# EasyEDA Pro project SimpleFOCShield v3-Redesigned.eprj

# Schematic SimpleFOCShield v3
Board Name: SimpleFOCShield v3; Create Date: 2024-10-09; Page Name: SimpleFOCShieldV3.SchDoc copy; Project Name: SimpleFOCShield v3; Schematic Name: SimpleFOCShield v3; Update Date: 2024-10-09; Add into BOM: yes; Company: SimpleFOCproject; Convert to PCB: yes; Date: 2024-04-28; Draw By: the.skuric; REV: 3.2; Sheet: 1/1
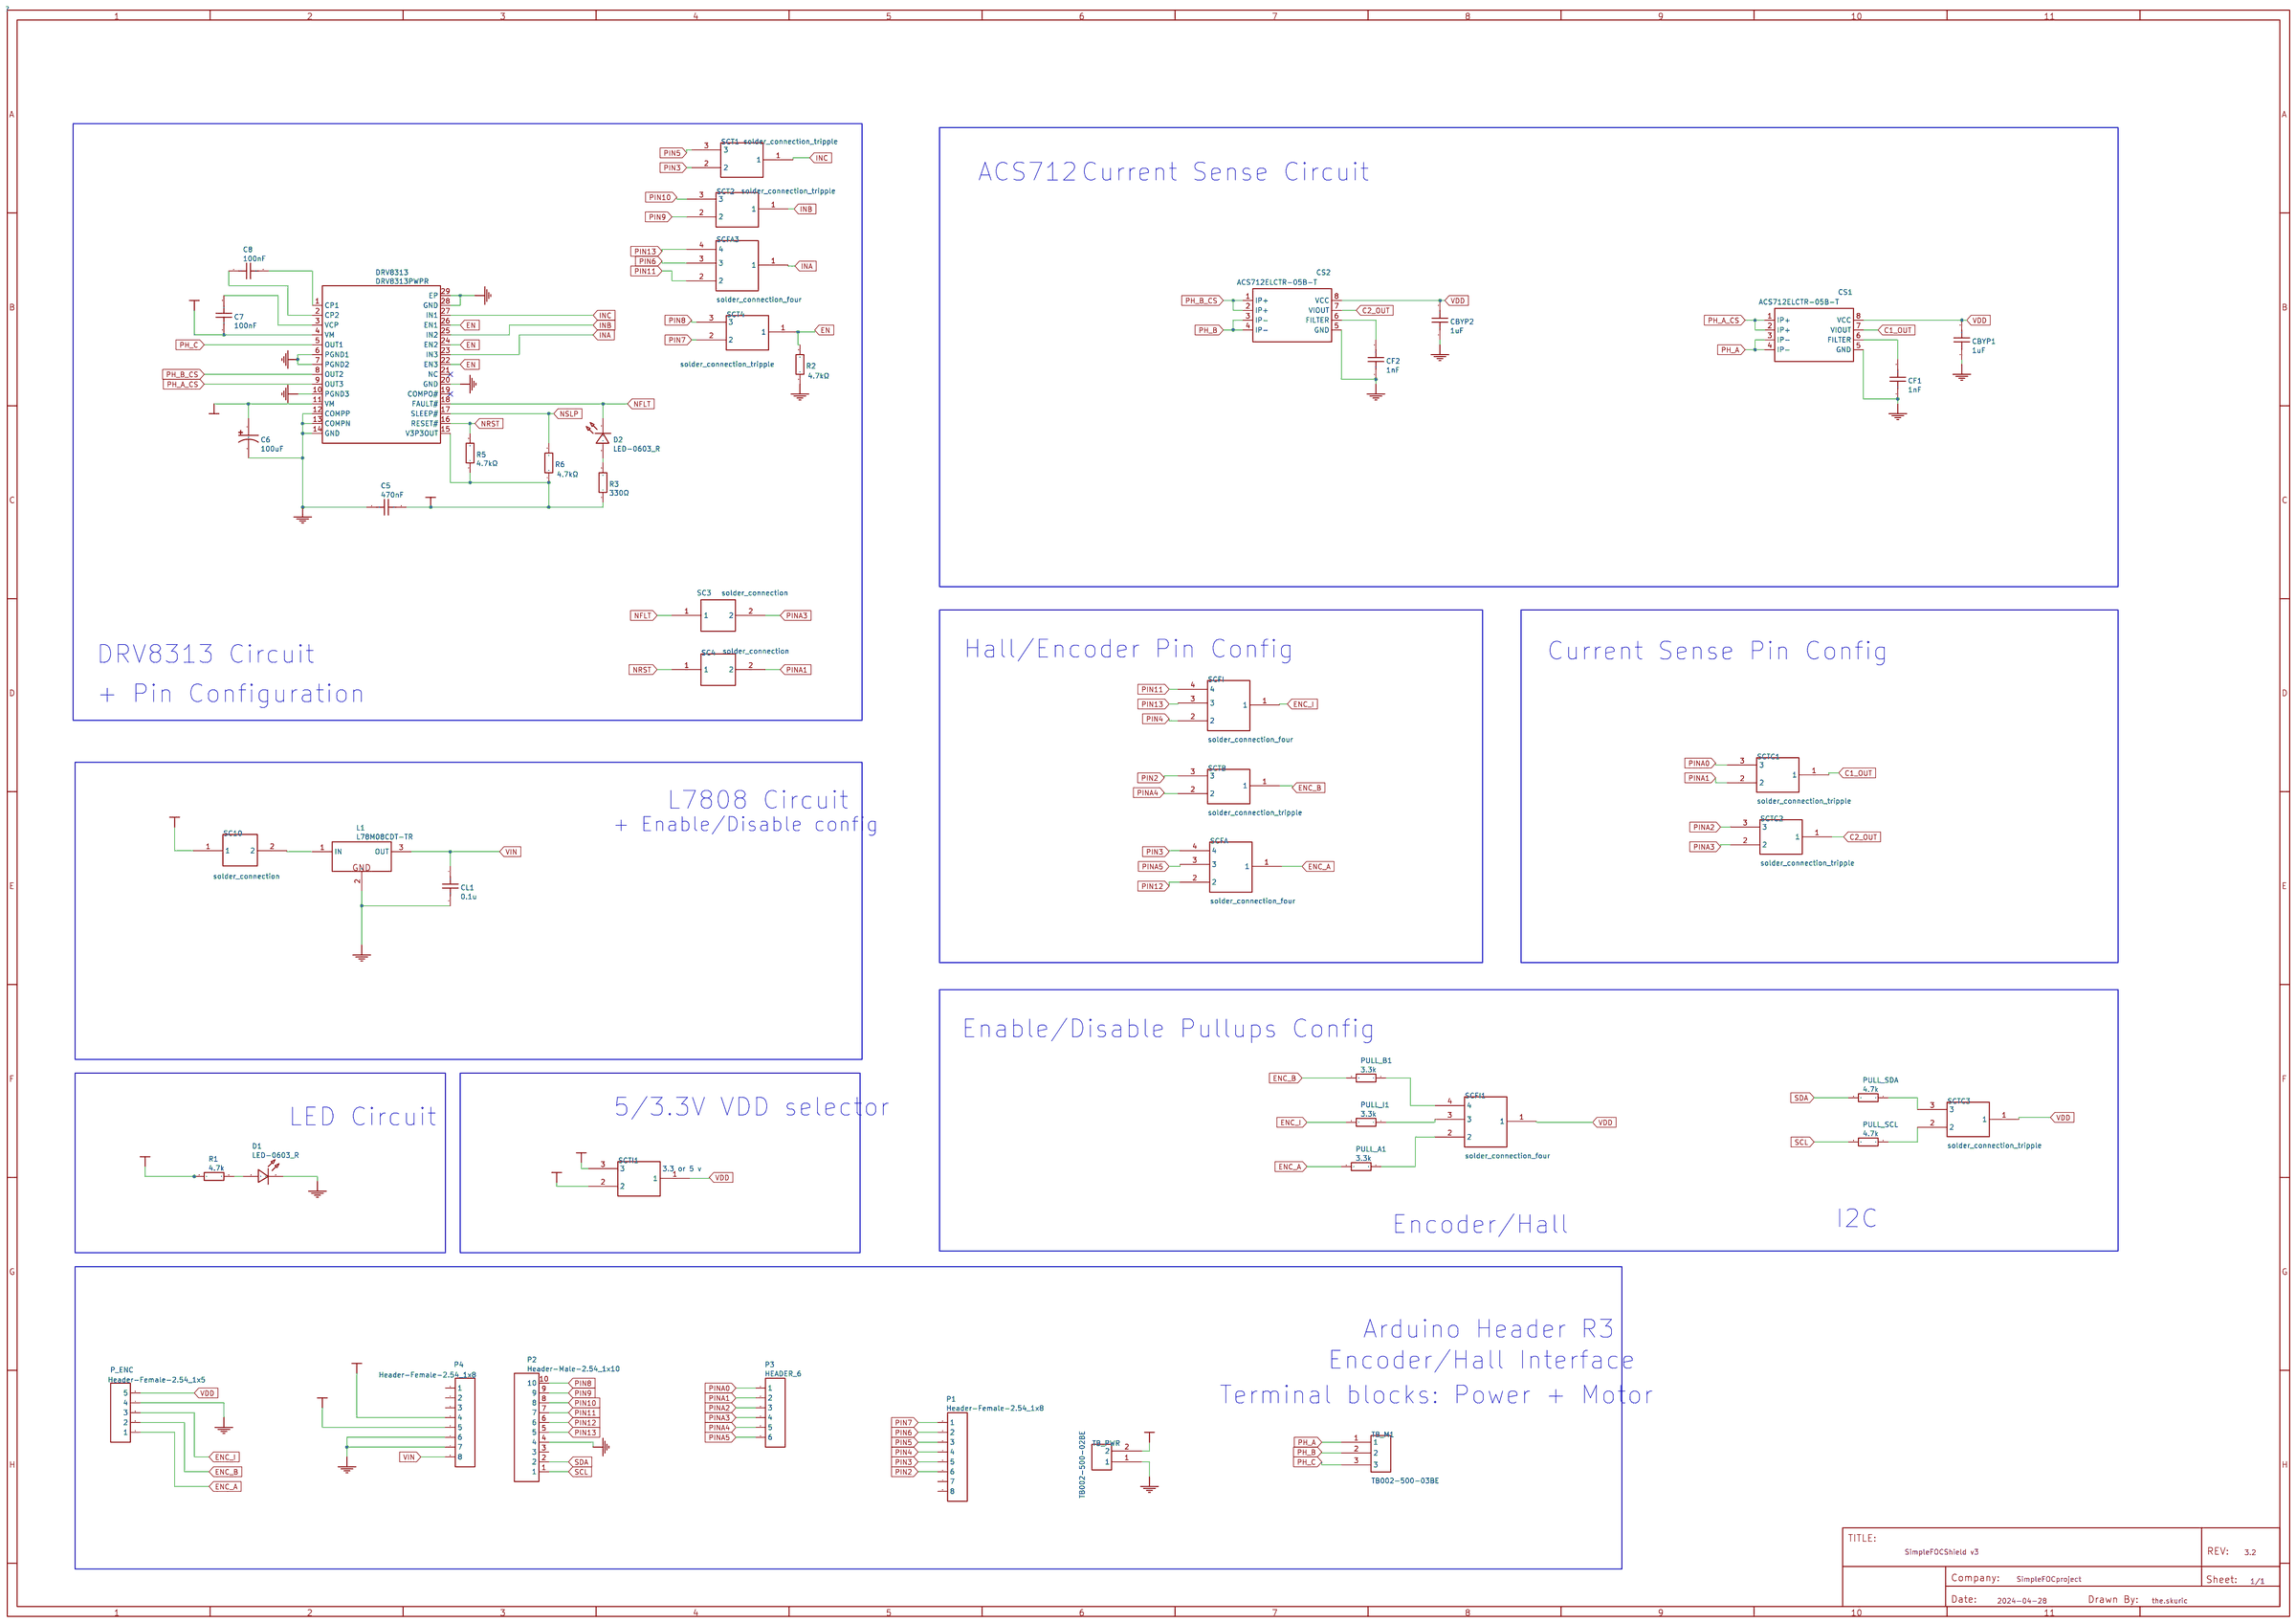
[diagram p0: schematic sheet]

## Parts
C5  470nF  [C0603_1]
C6  100uF  [CAP-SMD_BD6.3-L6.6-W6.6-FD]
C7  100nF  [C0603_1]
C8  100nF  [C0603_1]
CBYP1  1uF  [C0603_1]
CBYP2  1uF  [C0603_1]
CF1  1nF  [C0603_1]
CF2  1nF  [C0603_1]
CL1  0.1u  [C0603_1]
CS1  ACS712ELCTR-05B-T  [SOIC-8_L5.0-W4.0-P1.27-LS6.0-BL]
CS2  ACS712ELCTR-05B-T  [SOIC-8_L5.0-W4.0-P1.27-LS6.0-BL]
D1  LED-0603_R  [LED0603_RED]
D2  LED-0603_R  [LED0603_RED]
DRV8313  DRV8313PWPR  [HTSSOP-28_L9.8-W4.5-P0.65-LS6.6-BL-EP]
L1  L78M08CDT-TR  [TO-252-2_L6.6-W6.1-P4.57-LS9.9-TL-CW]
P1  Header-Female-2.54_1x8  [HDR-TH_8P-P2.54-V-F-1]  (no BOM)
P2  Header-Male-2.54_1x10  [HDR-TH_10P-P2.54-V-M-1]  (no BOM)
P3  HEADER_6  [HDR-M-2.54_1X6]  (no BOM)
P4  Header-Female-2.54_1x8  [HDR-TH_8P-P2.54-V-F-1]  (no BOM)
P_ENC  Header-Female-2.54_1x5  [HDR-TH_5P-P2.54-V-F]  (no BOM)
PULL_A1  3.3k  [R0603_1]
PULL_B1  3.3k  [R0603_1]
PULL_I1  3.3k  [R0603_1]
PULL_SCL  4.7k  [R0603_1]
PULL_SDA  4.7k  [R0603_1]
R1  4.7k  [R0603_1]
R2  4.7kΩ  [R0603_1]
R3  330Ω  [R0603_1]
R5  4.7kΩ  [R0603_1]
R6  4.7kΩ  [R0603_1]
SC3  solder_connection  [SOLDER_CONNECTION]  (no BOM)
SC4  solder_connection  [SOLDER_CONNECTION]  (no BOM)
SC10  solder_connection  [SOLDER_CONNECTION]  (no BOM)
SCFA  solder_connection_four  [SOLDER_CONNECTION_FOUR]  (no BOM)
SCFA3  solder_connection_four  [SOLDER_CONNECTION_FOUR]  (no BOM)
SCFI  solder_connection_four  [SOLDER_CONNECTION_FOUR]  (no BOM)
SCFI1  solder_connection_four  [SOLDER_CONNECTION_FOUR]  (no BOM)
SCT1  solder_connection_tripple  [SOLDER_CONNECTION_TRIPPLE]  (no BOM)
SCT2  solder_connection_tripple  [SOLDER_CONNECTION_TRIPPLE]  (no BOM)
SCT4  solder_connection_tripple  [SOLDER_CONNECTION_TRIPPLE]  (no BOM)
SCTB  solder_connection_tripple  [SOLDER_CONNECTION_TRIPPLE]  (no BOM)
SCTC1  solder_connection_tripple  [SOLDER_CONNECTION_TRIPPLE]  (no BOM)
SCTC2  solder_connection_tripple  [SOLDER_CONNECTION_TRIPPLE]  (no BOM)
SCTC3  solder_connection_tripple  [SOLDER_CONNECTION_TRIPPLE]  (no BOM)
SCTI1  3.3 or 5 v  [SOLDER_CONNECTION_TRIPPLE]  (no BOM)
TB_M1  TB002-500-03BE  [TB002-500-03BE]  (no BOM)
TB_PWR  TB002-500-02BE  [TB002-500-02BE]  (no BOM)

## Library data of the parts
C5 = 470nF: Supplier: LCSC; Supplier Part: C327269; Manufacturer: YAGEO; Manufacturer Part: CC0603ZRY5V6BB474
C6 = 100uF: Supplier: LCSC; Supplier Part: C294520; Manufacturer: Vertical Technology; Manufacturer Part: VT1V101M-CRE77
C7 C8 = 100nF: Supplier: LCSC; Manufacturer: SAMSUNG; Manufacturer Part: CL10B104KB8NNNC; Supplier Part: C1591
CBYP1 CBYP2 = 1uF
CF1 CF2 = 1nF
CL1 = 0.1u
CS1 CS2 = ACS712ELCTR-05B-T: Supplier: LCSC; Manufacturer: ALLEGRO(美国埃戈罗); Supplier Part: C44471; JLCPCB Part Class: Extended Part
D1 = LED-0603_R: Manufacturer: EVERLIGHT(台湾亿光); Manufacturer Part: 19-217/R6C-AL1M2VY/3T; Supplier Part: C72044; Supplier: LCSC
D2 = LED-0603_R: Manufacturer: EVERLIGHT(台湾亿光); Manufacturer Part: 19-217/R6C-AL1M2VY/3T; Supplier Part: C72044; Supplier: Add New Supplier
DRV8313 = DRV8313PWPR: Supplier: LCSC; Supplier Part: C92482; Manufacturer: Texas Instruments; JLCPCB Part Class: Extended Part
L1 = L78M08CDT-TR: Supplier: LCSC; Manufacturer: STMicroelectronics; Supplier Part: C158076; JLCPCB Part Class: Extended Part
P1 P4 = Header-Female-2.54_1x8: Supplier: LCSC; Manufacturer: BOOMELE; Manufacturer Part: Female headerHDR1X8-2.54; Supplier Part: C27438; JLCPCB Part Class: Extended Part
P2 = Header-Male-2.54_1x10: Supplier: LCSC; Manufacturer Part: Headers  Pins2.54mm1*10P; Supplier Part: C57369; JLCPCB Part Class: Extended Part
P3 = HEADER_6
P_ENC = Header-Female-2.54_1x5: Supplier: LCSC; Manufacturer: BOOMELE; Manufacturer Part: 2.54mm 1*5p Female header; Supplier Part: C50950; JLCPCB Part Class: Extended Part
PULL_A1 PULL_B1 PULL_I1 = 3.3k: Supplier: LCSC; JLCPCB Part Class: Basic Part
PULL_SCL PULL_SDA R1 = 4.7k: Supplier: LCSC; Manufacturer: UniOhm; Manufacturer Part: 0603WAF4701T5E; Supplier Part: C23162; Resistance: 4.7K; JLCPCB Part Class: Basic Part
R2 R5 R6 = 4.7kΩ: Supplier: LCSC; Manufacturer: UniOhm; Manufacturer Part: 0603WAF4701T5E; Supplier Part: C23162; Resistance: 4.7K; JLCPCB Part Class: Basic Part
R3 = 330Ω: Resistance: 330; JLCPCB Part Class: Basic Part
SC3 SC4 SC10 = solder_connection
SCFA SCFA3 SCFI SCFI1 = solder_connection_four
SCT1 SCT2 SCT4 SCTB SCTC1-SCTC3 = solder_connection_tripple
SCTI1 = 3.3 or 5 v
TB_M1 = TB002-500-03BE: Supplier 1: Mouser; Supplier Part Number 1: 490-TB002-500-03BE
TB_PWR = TB002-500-02BE: Supplier 1: Mouser; Supplier Part Number 1: 490-TB002-500-02BE

## Nets
3.3V: C5.2 DRV8313.15(V3P3OUT) R3.1 R5.1 R6.1
+5V: P4.5 SCTI1.2
GND: C5.1 C6.2 CBYP1.1 CBYP2.1 CF1.1 CF2.1 CL1.2 CS1.5(GND) CS2.5(GND) D1.2 DRV8313.6(PGND1) DRV8313.7(PGND2) DRV8313.10(PGND3) DRV8313.12(COMPP) DRV8313.13(COMPN) DRV8313.14(GND) DRV8313.20(GND) DRV8313.28(GND) DRV8313.29(EP) L1.2(GND) P2.4 P4.6 P4.7 P_ENC.4 R2.1 TB_PWR.1
P3.3V: P4.4 SCTI1.3
VCC: C6.1 C7.1 DRV8313.4(VM) DRV8313.11(VM) R1.2 SC10.1 TB_PWR.2
VDD: CBYP1.2 CBYP2.2 CS1.8(VCC) CS2.8(VCC) P_ENC.5 SCFI1.1 SCTC3.1 SCTI1.1
VIN: CL1.1 L1.3(OUT) P4.8
C1_OUT: CS1.7(VIOUT) SCTC1.1
C2_OUT: CS2.7(VIOUT) SCTC2.1
EN: DRV8313.22(EN3) DRV8313.24(EN2) DRV8313.26(EN1) R2.2 SCT4.1
ENC_A: P_ENC.1 PULL_A1.2 SCFA.1
ENC_B: P_ENC.2 PULL_B1.2 SCTB.1
ENC_I: P_ENC.3 PULL_I1.2 SCFI.1
INA: DRV8313.23(IN3) SCFA3.1
INB: DRV8313.25(IN2) SCT2.1
INC: DRV8313.27(IN1) SCT1.1
NFLT: D2.2 DRV8313.18(FAULT#) SC3.1
NRST: DRV8313.16(RESET#) R5.2 SC4.1
NSLP: DRV8313.17(SLEEP#) R6.2
PH_A: CS1.3(IP-) CS1.4(IP-) TB_M1.1
PH_A_CS: CS1.1(IP+) CS1.2(IP+) DRV8313.9(OUT3)
PH_B: CS2.3(IP-) CS2.4(IP-) TB_M1.2
PH_B_CS: CS2.1(IP+) CS2.2(IP+) DRV8313.8(OUT2)
PH_C: DRV8313.5(OUT1) TB_M1.3
PIN2: P1.6 SCTB.3
PIN3: P1.5 SCFA.4 SCT1.2
PIN4: P1.4 SCFI.2
PIN5: P1.3 SCT1.3
PIN6: P1.2 SCFA3.3
PIN7: P1.1 SCT4.2
PIN8: P2.10 SCT4.3
PIN9: P2.9 SCT2.2
PIN10: P2.8 SCT2.3
PIN11: P2.7 SCFA3.2 SCFI.4
PIN12: P2.6 SCFA.2
PIN13: P2.5 SCFA3.4 SCFI.3
PINA0: P3.1 SCTC1.3
PINA1: P3.2 SC4.2 SCTC1.2
PINA2: P3.3 SCTC2.3
PINA3: P3.4 SC3.2 SCTC2.2
PINA4: P3.5 SCTB.2
PINA5: P3.6 SCFA.3
SCL: P2.1 PULL_SCL.2
SDA: P2.2 PULL_SDA.2
$1N20: C7.2 DRV8313.3(VCP)
$1N21: C8.1 DRV8313.2(CP2)
$1N22: C8.2 DRV8313.1(CP1)
$1N41: L1.1(IN) SC10.2
$1N43: D1.1 R1.1
$1N70: PULL_SDA.1 SCTC3.3
$1N110: CF2.2 CS2.6(FILTER)
$1N112: CF1.2 CS1.6(FILTER)
$1N114: D2.1 R3.2
$1N120: PULL_SCL.1 SCTC3.2
$1N122: PULL_A1.1 SCFI1.2
$1N125: PULL_B1.1 SCFI1.4
$1N126: PULL_I1.1 SCFI1.3

Not connected (* = marked no-connect by the designer): DRV8313 19(COMPO#)* 21(NC)*; P1 7 8; P2 3; P4 1 2 3

## Notes on the sheet
- ACS712
- Current Sense Circuit
- DRV8313 Circuit
- Hall/Encoder Pin Config
- Current Sense Pin Config
- + Pin Configuration
- L7808 Circuit
- + Enable/Disable config
- Enable/Disable Pullups Config
- 5/3.3V VDD selector
- LED Circuit
- Encoder/Hall
- I2C
- Arduino Header R3
- Encoder/Hall Interface
- Terminal blocks: Power + Motor

# Board SimpleFOCShieldV3.PcbDoc copy
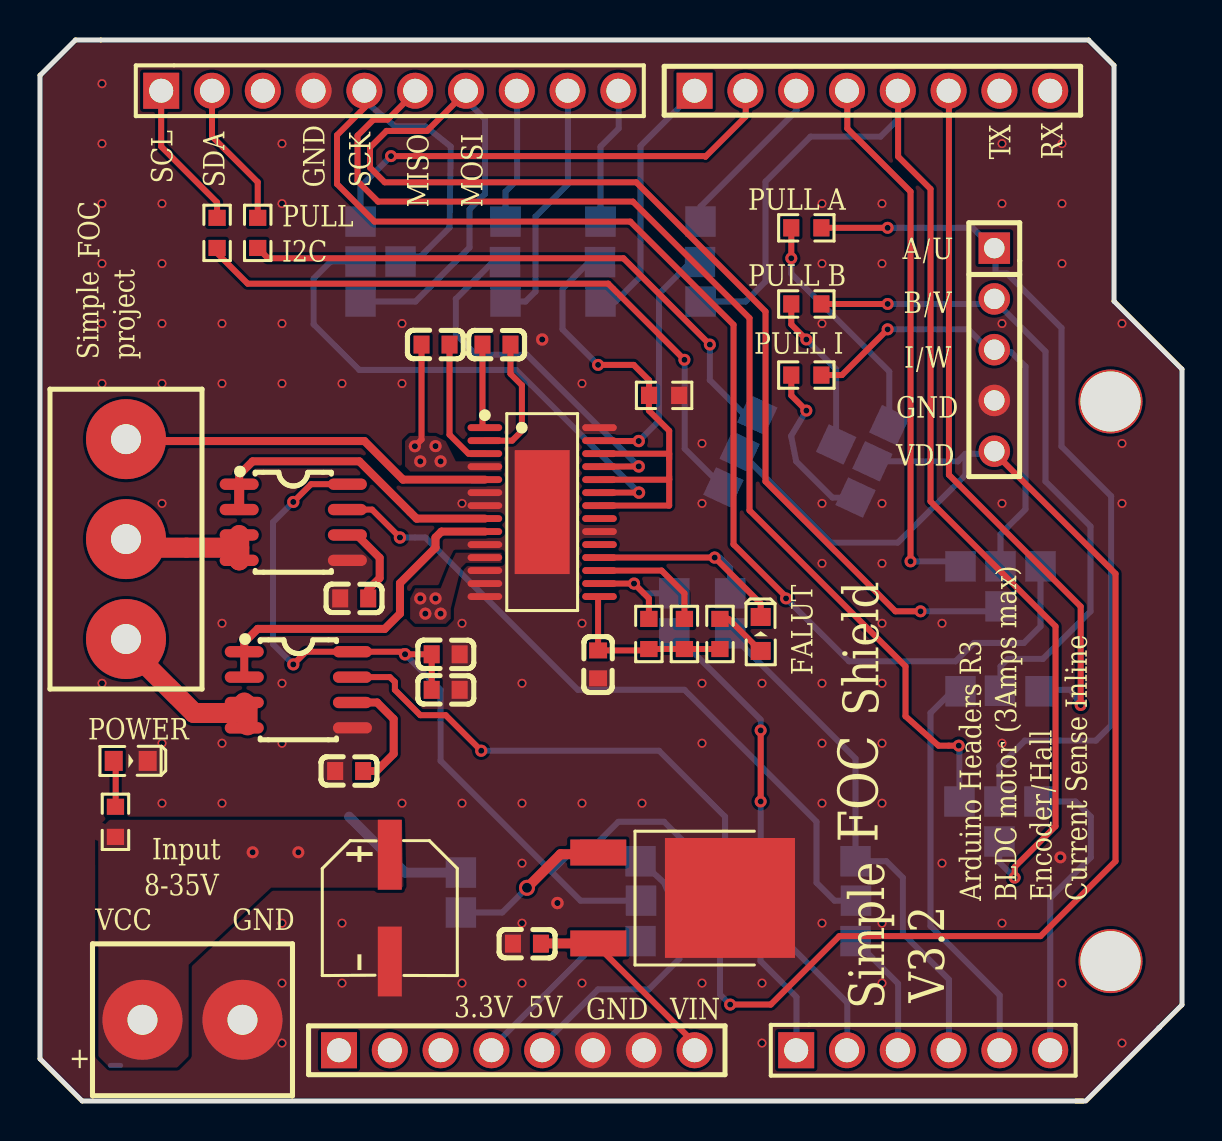
[diagram p1: board, top side]
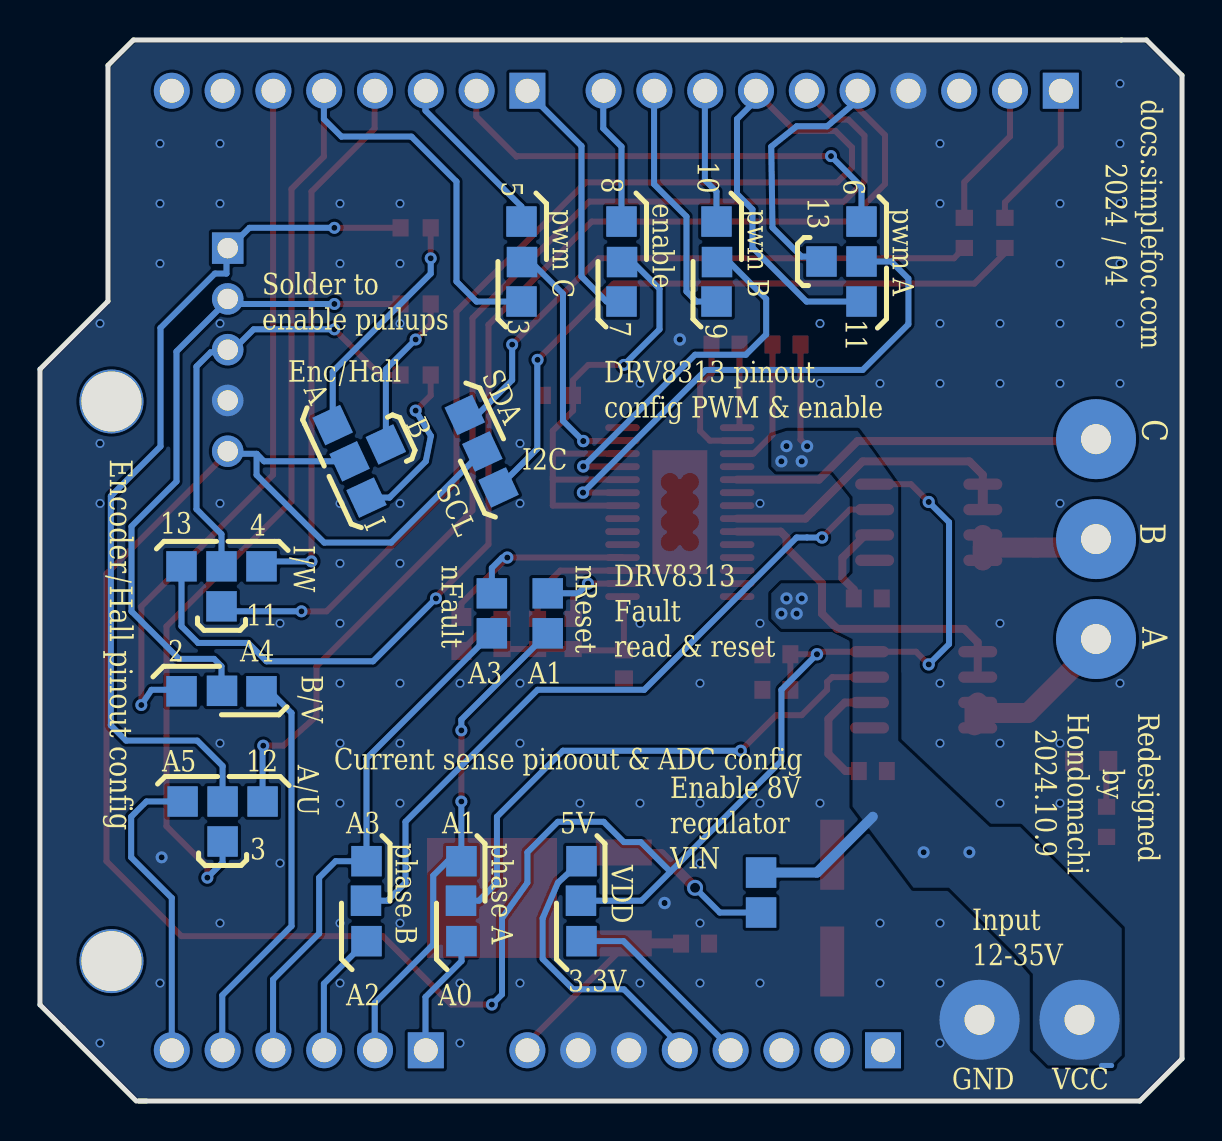
[diagram p2: board, bottom side, seen from below]

Outline 57.1 x 53.09 mm; copper layers: Top Layer, Bottom Layer. Coordinates in mm from the lower left corner of the outline.
Outline path: 51.78,0 52.16,0 2.11,0 0,2.11 0,51.31 1.78,53.09 52.43,53.09 53.7,51.81 53.7,40.01 57.1,36.61 57.1,4.81 52.29,0
Stack: Top Layer 0.035mm / Dielectric1 1.51mm FR4 er 4.5 / Bottom Layer 0.035mm

## Design rules (mm)
spacing Default (default): track to track 0.152, other pairs 0 to 0.152
spacing Plane_Default: track to track 0.152, other pairs 0 to 0.152
spacing Copper_Default: track to track 0.152, other pairs 0 to 0.152
spacing Copper_CopperRegion: track to track 0.152, other pairs 0 to 0.152
spacing Copper_(1): track to track 0.152, other pairs 0 to 0.152
spacing Copper_(2): track to track 0.152, other pairs 0 to 0.152
spacing Copper_(3): track to track 0.152, other pairs 0 to 0.152
track width Default (default): min 0.152, default 0.152, max 25.4
differential pair differentialPair (default): width min 0.127, default 0.254, max 2.54; gap min 0.152, default 0.152
pour e545 uses (1), Copper_Default
pour e551 uses Copper_Default, Default
pour e556 uses (3), Copper_Default
pour e548 uses Copper_Default

## Placement (name value [footprint] x y rotation side)
C5  470nF  [C0603_1]  27.9 21.84 90 top
C6  100uF  [CAP-SMD_BD6.3-L6.6-W6.6-FD]  17.49 9.65 270 top
C7  100nF  [C0603_1]  19.78 37.85 0 top
C8  100nF  [C0603_1]  22.82 37.85 180 top
CBYP1  1uF  [C0603_1]  20.28 22.35 180 top
CBYP2  1uF  [C0603_1]  20.28 20.57 180 top
CF1  1nF  [C0603_1]  15.46 16.51 0 top
CF2  1nF  [C0603_1]  15.71 25.14 0 top
CL1  0.1u  [C0603_1]  24.35 7.87 180 top
CS1  ACS712ELCTR-05B-T  [SOIC-8_L5.0-W4.0-P1.27-LS6.0-BL]  12.92 20.57 270 top
CS2  ACS712ELCTR-05B-T  [SOIC-8_L5.0-W4.0-P1.27-LS6.0-BL]  12.66 28.96 270 top
D1  LED-0603_R  [LED0603_RED]  4.54 17.02 0 top
D2  LED-0603_R  [LED0603_RED]  36.03 23.37 90 top
DRV8313  DRV8313PWPR  [HTSSOP-28_L9.8-W4.5-P0.65-LS6.6-BL-EP]  25.11 29.46 270 top
L1  L78M08CDT-TR  [TO-252-2_L6.6-W6.1-P4.57-LS9.9-TL-CW]  31.21 10.16 0 top
NOREF  -  [Pad_e135]  53.53 35 0 top
NOREF#2  -  [Pad_e136]  53.53 7 0 top
P1  Header-Female-2.54_1x8  [HDR-TH_8P-P2.54-V-F-1]  41.62 50.55 0 top
P2  Header-Male-2.54_1x10  [HDR-TH_10P-P2.54-V-M-1]  17.49 50.55 0 top
P3  HEADER_6  [HDR-M-2.54_1X6]  44.16 2.54 0 top
P4  Header-Female-2.54_1x8  [HDR-TH_8P-P2.54-V-F-1]  23.84 2.54 0 top
P_ENC  Header-Female-2.54_1x5  [HDR-TH_5P-P2.54-V-F]  47.72 37.59 270 top
PULL_A1  3.3k  [R0603_1]  38.32 43.69 0 top
PULL_B1  3.3k  [R0603_1]  38.32 39.88 0 top
PULL_I1  3.3k  [R0603_1]  38.32 36.32 0 top
PULL_SCL  4.7k  [R0603_1]  8.85 43.43 90 top
PULL_SDA  4.7k  [R0603_1]  10.89 43.43 90 top
R1  4.7k  [R0603_1]  3.77 13.97 270 top
R2  4.7kΩ  [R0603_1]  31.21 35.3 180 top
R3  330Ω  [R0603_1]  34 23.37 90 top
R5  4.7kΩ  [R0603_1]  30.44 23.37 90 top
R6  4.7kΩ  [R0603_1]  32.22 23.37 90 top
SC3  solder_connection  [SOLDER_CONNECTION]  34.51 25.4 270 bottom
SC4  solder_connection  [SOLDER_CONNECTION]  31.71 25.4 270 bottom
SC10  solder_connection  [SOLDER_CONNECTION]  21.05 11.43 270 bottom
SCFA  solder_connection_four  [SOLDER_CONNECTION_FOUR]  47.97 14.99 180 bottom
SCFA3  solder_connection_four  [SOLDER_CONNECTION_FOUR]  16.03 42 270 bottom
SCFI  solder_connection_four  [SOLDER_CONNECTION_FOUR]  48.03 26.75 180 bottom
SCFI1  solder_connection_four  [SOLDER_CONNECTION_FOUR]  41.62 32 65 bottom
SCT1  solder_connection_tripple  [SOLDER_CONNECTION_TRIPPLE]  33.03 42 270 bottom
SCT2  solder_connection_tripple  [SOLDER_CONNECTION_TRIPPLE]  23.28 42 270 bottom
SCT4  solder_connection_tripple  [SOLDER_CONNECTION_TRIPPLE]  28.03 42 270 bottom
SCTB  solder_connection_tripple  [SOLDER_CONNECTION_TRIPPLE]  48.03 20.5 180 bottom
SCTC1  solder_connection_tripple  [SOLDER_CONNECTION_TRIPPLE]  36.03 10 90 bottom
SCTC2  solder_connection_tripple  [SOLDER_CONNECTION_TRIPPLE]  40.78 10 90 bottom
SCTC3  solder_connection_tripple  [SOLDER_CONNECTION_TRIPPLE]  35.02 32.51 245 bottom
SCTI1  3.3 or 5 v  [SOLDER_CONNECTION_TRIPPLE]  30.03 10 90 bottom
TB_M1  -  [TB002-500-03BE]  4.3 23.11 90 top
TB_PWR  -  [TB002-500-02BE]  10.12 4.06 180 top

## Footprints (pads in the part's own frame, mm; a bottom-side part is the same pattern mirrored in y, then rotated)
C0603_1
  rect 0.8x0.9 smd: 1(-0.7,0) 2(0.7,0)
CAP-SMD_BD6.3-L6.6-W6.6-FD
  rect 3.5x1.2 smd: 1(-2.67,0) 2(2.67,0)
HDR-M-2.54_1X6
  rect 1.8x1.8 hole 1.2: 1(-6.35,0)
  round 1.8 hole 1.2: 2(-3.81,0) 3(-1.27,0) 4(1.27,0) 5(3.81,0) 6(6.35,0)
HDR-TH_5P-P2.54-V-F
  rect 1.575x1.575 hole 1.02: 1(-5.08,0)
  round 1.575 hole 1.02: 2(-2.54,0) 3(0,0) 4(2.54,0) 5(5.08,0)
HDR-TH_8P-P2.54-V-F-1
  rect 1.8x1.8 hole 1.2: 1(-8.89,0)
  round 1.8 hole 1.2: 2(-6.35,0) 3(-3.81,0) 4(-1.27,0) 5(1.27,0) 6(3.81,0) 7(6.35,0) 8(8.89,0)
HDR-TH_10P-P2.54-V-M-1
  rect 1.8x1.8 hole 1.2: 1(-11.43,0)
  round 1.8 hole 1.2: 2(-8.89,0) 3(-6.35,0) 4(-3.81,0) 5(-1.27,0) 6(1.27,0) 7(3.81,0) 8(6.35,0) 9(8.89,0) 10(11.43,0)
HTSSOP-28_L9.8-W4.5-P0.65-LS6.6-BL-EP
  oval 0.343x1.732 smd: 1(-4.225,-2.865) 2(-3.575,-2.865) 3(-2.925,-2.865) 4(-2.275,-2.865) 5(-1.625,-2.865) 6(-0.975,-2.865) 7(-0.325,-2.865) 8(0.325,-2.865) 9(0.975,-2.865) 10(1.625,-2.865) 11(2.275,-2.865) 12(2.925,-2.865) 13(3.575,-2.865) 14(4.225,-2.865) 15(4.225,2.866) 16(3.575,2.866) 17(2.925,2.866) 18(2.275,2.866) 19(1.625,2.866) 20(0.975,2.866) 21(0.325,2.866) 22(-0.325,2.866) 23(-0.975,2.866) 24(-1.625,2.866) 25(-2.275,2.866) 26(-2.925,2.866) 27(-3.575,2.866) 28(-4.225,2.866)
  rect 6.2x2.75 smd: 29(0,0.001)
LED0603_RED
  rect 0.9x1 smd: 1(-0.85,0) 2(0.85,0)
Pad_e135
  round 3.2 hole 3.005x3: T2(0,0)
Pad_e136
  round 3.2 hole 3.005x3: T3(0,0)
R0603_1
  rect 0.806x0.864 smd: 1(-0.753,0) 2(0.753,0)
SOIC-8_L5.0-W4.0-P1.27-LS6.0-BL
  oval 0.569x1.95 smd: 1(-1.905,-2.705) 2(-0.635,-2.705) 3(0.635,-2.705) 4(1.905,-2.705) 5(1.905,2.705) 6(0.635,2.705) 7(-0.635,2.705) 8(-1.905,2.705)
SOLDER_CONNECTION
  rect 1.524x1.524 smd: 1(0,0) 2(2,0)
SOLDER_CONNECTION_FOUR
  rect 1.524x1.524 smd: 1(0,0) 2(2,0) 3(-2,0) 4(0,-2)
SOLDER_CONNECTION_TRIPPLE
  rect 1.524x1.524 smd: 1(0.025,0.025) 2(2,0) 3(-2,0)
TB002-500-02BE
  round 4 hole 1.5: 1(0,0) 2(5,0)
TB002-500-03BE
  round 4 hole 1.5: 1(0,0) 2(5,0) 3(10,0)
TO-252-2_L6.6-W6.1-P4.57-LS9.9-TL-CW
  rect 2.8x1.3 smd: 1(-3.292,2.273) 3(-3.292,-2.272)
  rect 6.5x6 smd: 2(3.292,0)

## Nets
As in the schematic.

Pads without a net: DRV8313 19 21; NOREF T2; NOREF#2 T3; P1 7 8; P2 3; P4 1 2 3

## Via types
v1: diameter 0.61, hole 0.305, Top Layer to Bottom Layer, 13 vias
v2: diameter 0.6, hole 0.3, Top Layer to Bottom Layer, 22 vias
v3: diameter 0.45, hole 0.3, Top Layer to Bottom Layer, 91 vias
v4: diameter 0.62, hole 0.31, Top Layer to Bottom Layer, 7 vias
v5: diameter 0.8, hole 0.5, Top Layer to Bottom Layer, 1 via

## Routing (per net, layer and track width the routed paths; a pad name or vN(x,y) marks a point on that pad's centre or on a via; arc(x,y) is an arc through that point)
3.3V: length 8.9
  Top Layer w0.3: 27.98,25.24 27.9,25.17 C5.2 30.37,22.54 R5.1 R3.1
+5V: length 14.5
  Bottom Layer w0.3: P4.5 25.11,2.79 27.9,5.59 30.44,5.59 31.97,7.11 31.97,9.14 31.21,10.92 SCTI1.2
GND:
  vias: v2(51.02,12.19) v3(3.1,50.9) v3(3.1,47.9) v3(3.1,44.9) v3(3.1,41.9) v3(3.1,38.9) v3(3.1,35.9) v3(3.1,20.9) v3(6.1,44.9) v3(6.1,41.9) v3(6.1,38.9) v3(6.1,35.9) v3(6.1,29.9) v3(6.1,17.9) v3(6.1,14.9) v3(9.1,38.9) v3(9.1,35.9) v3(9.1,23.9) v3(9.1,17.9) v3(9.1,14.9) v3(12.1,47.9) v3(12.1,44.9) v3(12.1,38.9) v3(12.1,35.9) v3(12.1,20.9) v3(12.1,17.9) v3(12.1,8.9) v3(12.1,5.9) v3(12.1,2.9) v3(15.1,35.9) v3(15.1,8.9) v3(15.1,5.9) v3(18.1,38.9) v3(18.1,35.9) v3(18.1,14.9) v3(21.1,29.9) v3(21.1,23.9) v3(21.1,14.9) v3(21.1,5.9) v3(24.1,20.9) v3(24.1,14.9) v3(24.1,11.9) v3(24.1,8.9) v3(24.1,5.9) v3(27.1,35.9) v3(27.1,23.9) v3(27.1,14.9) v3(27.1,5.9) v3(30.1,14.9) v3(33.1,32.9) v3(33.1,29.9) v3(33.1,20.9) v3(33.1,17.9) v3(33.1,5.9) v3(36.1,20.9) v3(36.1,5.9) v3(36.1,2.9) v3(39.1,44.9) v3(39.1,41.9) v3(39.1,38.9) v3(39.1,29.9) v3(39.1,26.9) v3(39.1,20.9) v3(39.1,17.9) v3(39.1,14.9) v3(39.1,8.9) v3(42.1,44.9) v3(42.1,41.9) v3(42.1,29.9) v3(42.1,26.9) v3(42.1,23.9) v3(42.1,20.9) v3(42.1,17.9) v3(42.1,14.9) v3(42.1,8.9) v3(42.1,5.9) v3(45.1,23.9) v3(45.1,11.9) v3(48.1,47.9) v3(48.1,44.9) v3(48.1,38.9) v3(48.1,29.9) v3(48.1,17.9) v3(48.1,8.9) v3(51.1,47.9) v3(51.1,44.9) v3(51.1,41.9) v3(51.1,5.9) v3(54.1,38.9) v3(54.1,32.9) v3(54.1,29.9) v3(54.1,2.9) v4(25.11,38.1) v4(25.87,9.91)
P3.3V: length 9.8
  Bottom Layer w0.3: 22.57,2.54 22.57,2.64 27.93,8 30.03,8
VCC: length 12.8
  Top Layer w0.3: v1(18.74,32.76) 19.08,33.09 C7.1
  Top Layer w0.5: 3.53,4 3.53,4.35
  Bottom Layer w0.254: 4.03,1.78 3.52,1.78
  Bottom Layer w0.5: SC10.1 18.25,11.43 15.46,14.22
  vias: v1(19.01,32) v1(19.01,25.15) v1(19.27,24.38) v1(19.78,32.77) v1(19.78,25.15) v1(20.03,32) v1(20.03,24.38) v2(10.63,12.45) v2(12.92,12.45)
VDD: length 124.2
  Top Layer w0.3: CS2.8 13.55,30.86 v1(12.66,29.97) ; v1(12.66,21.84) 13.3,22.48 CS1.8 18.12,22.48 v4(18.25,22.35) 19.58,22.35 CBYP2.2 ; v2(34.51,4.83) 36.54,4.83 39.96,8.25 50.03,8.25 53.78,12 53.78,26.38 47.78,32.38
  Bottom Layer w0.3: v1(12.66,29.97) 11.65,28.96 11.65,22.86 v1(12.66,21.84) ; 46.27,32.38 47.78,32.38 ; 46.27,32.38 46.27,31.32 42.89,27.94 39.54,27.94 34.98,32.5 ; 46.27,32.38 45.9,32 SCFI1.1 ; 25.58,11.47 27.06,12.95 27.9,12.95 28.92,13.97 31.21,13.97 32.73,12.45 32.73,10.92 34,9.14 34,5.33 v2(34.51,4.83) ; SCTI1.1 27.02,10.02 20.03,17.02 20.03,20.57 v4(18.25,22.35)
VIN: length 10.1
  Top Layer w0.3: 32.73,2.54 32.73,2.9 27.85,7.78
  Top Layer w0.5: L1.3 25.31,7.89 CL1.1
C1_OUT: length 27.2
  Top Layer w0.3: v1(22.06,17.53) 20.28,19.3 19.01,19.3 17.74,20.57 17.74,20.97 17.49,21.21 CS1.7
  Bottom Layer w0.3: SCTC1.1 35.15,10.02 34.25,10.92 34.25,14.22 30.95,17.53 v1(22.06,17.53)
C2_OUT: length 35.3
  Top Layer w0.3: CS2.7 16.6,29.59 v4(18,28.19)
  Bottom Layer w0.3: 40.8,10.02 39.72,10.02 38.83,10.92 38.83,13.97 32.22,20.57 26.89,20.57 19.27,28.19 v4(18,28.19)
EN: length 27.4
  Top Layer w0.3: 30.44,35.31 30.44,34.54 31.46,33.53 31.46,32.13 ; DRV8313.26 31.46,32.39 31.46,31.09 DRV8313.24 ; DRV8313.22 31.46,29.79 31.46,31.24 ; v2(27.9,36.83) 29.68,36.83 30.45,36.06 R2.2
  Bottom Layer w0.3: SCT4.1 27.46,41.98 26.13,40.64 26.13,38.61 v2(27.9,36.83)
ENC_A: length 43.8
  Top Layer w0.3: 39.07,43.69 v2(42.38,43.69)
  Bottom Layer w0.3: 47.78,43 47.78,41.4 48.36,41.4 51.08,38.68 51.08,32.75 53.56,30.26 53.56,18.8 52.8,18.03 49.24,18.03 47.97,16.76 47.97,15.49 ; v2(42.38,43.69) 46.63,43.69 47.78,42.54
ENC_B: length 33.2
  Top Layer w0.3: 39.07,39.88 v2(42.38,39.88)
  Bottom Layer w0.3: v2(42.38,39.88) 47.78,39.88 47.78,40 50.28,37.5 50.28,31 52.53,28.75 52.53,24.5 50.15,22.12 48.4,22.12 48.03,21.75 48.03,20.5
ENC_I: length 22.7
  Top Layer w0.3: v2(42.38,38.61) 40.1,36.32 39.07,36.32
  Bottom Layer w0.3: 48.03,26.75 48.03,28.36 49.28,29.61 49.28,36.75 48.57,37.46 47.78,37.46 47.78,37.25 46.42,38.61 v2(42.38,38.61)
INA: length 26.7
  Top Layer w0.3: 27.98,30.44 v4(29.95,30.44)
  Bottom Layer w0.3: SCFA3.1 14.53,42 13.68,41.15 13.68,38.86 15.97,36.58 23.81,36.58 v4(29.95,30.44)
INB: length 18.8
  Top Layer w0.3: 27.98,31.74 v4(29.94,31.75)
  Bottom Layer w0.3: v4(29.94,31.75) 24.35,37.34 21.81,37.34 20.79,38.35 20.79,40.13 22.64,41.98 SCT2.1
INC: length 12.7
  Top Layer w0.3: 29.68,33.02 v4(29.94,33.02) 28,33.02 27.98,33.04
  Bottom Layer w0.3: v4(29.94,33.02) 30.95,34.04 30.95,40.39 32.54,41.98 SCT1.1
NFLT: length 11.9
  Top Layer w0.3: DRV8313.18 v1(33.73,27.19) 36.03,24.89 D2.2
  Bottom Layer w0.3: SC3.1 34.51,26.67 33.99,27.19 v1(33.73,27.19)
NRST: length 6
  Top Layer w0.3: 30.44,24.12 30.44,25.15 v1(29.7,25.89) DRV8313.16
  Bottom Layer w0.3: SC4.1 30.19,25.4 v1(29.7,25.89)
NSLP: length 6
  Top Layer w0.3: 27.98,26.54 31.08,26.54 32.22,25.4 32.22,24.12
PH_A: length 8.5
  Top Layer w1: 10.38,18.8 10.38,19.81 ; 10.21,19.94 9.69,19.41 7.7,19.41 4.32,22.79
PH_A_CS: length 17.3
  Top Layer w0.4: DRV8313.9 20.07,28.49 19.78,28.19 19.78,27.69 18,25.91 18,24.38 17.24,23.62 10.89,23.62 10.21,22.95 10.21,21.21
PH_B: length 7.8
  Top Layer w1: 9.96,28.32 9.96,27.05 9.96,27.69 4.71,27.69 4.28,28.11
PH_B_CS: length 15.5
  Top Layer w0.4: 9.96,30.86 9.96,31.33 10.63,32 15.97,32 18.83,29.14 22.24,29.14
  Top Layer w0.5: 9.96,30.86 9.96,29.59
PH_C: length 18.8
  Top Layer w0.4: 4.28,33.11 4.38,33.02 16.22,33.02 18.15,31.09 DRV8313.5
PIN2: length 36.1
  Top Layer w0.3: 45.45,50.5 45.45,31.33 52.03,24.74 v2(52.03,19.81)
  Bottom Layer w0.3: 49.75,20.57 51.53,20.57 v2(52.03,19.81)
PIN3: length 64
  Top Layer w0.3: 42.91,50.5 42.91,47.25 44.53,45.63 44.53,30 50.78,23.75 50.78,13.75 48.73,11.71 v2(48.73,11.18)
  Bottom Layer w0.3: 42.91,50.5 42.91,49.13 42.03,48.25 38.53,48.25 36.28,46 36.28,41 35.28,40 SCT1.2 ; 47.97,13.49 47.97,11.94 v2(48.73,11.18)
PIN4: length 27.2
  Top Layer w0.3: 40.37,50.5 40.37,48.66 43.53,45.5 43.53,27.25
  Bottom Layer w0.3: 46.03,26.75 45.78,27 v2(43.53,27)
PIN5: length 8.5
  Bottom Layer w0.3: SCT1.3 33.03,44.75 37.83,49.55 37.83,50.5
PIN6: length 23.5
  Top Layer w0.3: 35.29,50.5 35.29,49.26 33.28,47.25 33.25,47.27 v2(17.55,47.27)
  Bottom Layer w0.3: 16.03,44.25 16.03,45.75 v2(17.55,47.27)
PIN7: length 12.9
  Bottom Layer w0.3: 32.75,50.5 30.03,47.78 30.03,41.25 28.78,40 28.03,40
PIN8: length 6.9
  Bottom Layer w0.3: 28.94,50.5 28.94,48.66 28.03,47.75 28.03,44
PIN9: length 12.4
  Bottom Layer w0.3: 26.4,50.5 26.4,45.87 24.78,44.25 24.78,40.5 24.28,40 SCT2.2
PIN10: length 6.7
  Bottom Layer w0.3: SCT2.3 23.28,45.5 23.86,46.08 23.86,50.5
PIN11: length 68
  Top Layer w0.3: 21.32,50.5 19.35,48.53 17.33,48.53 16.5,47.71 16.5,46.7 17.24,45.96 29.81,45.96 36.28,39.5 36.28,31 42.77,24.5 v2(44.03,24.5)
  Bottom Layer w0.3: 16.03,40.25 16.28,40 18.78,40 21.48,42.7 21.48,44.61 22.25,45.38 22.25,49.12 21.48,49.9 21.48,50.34 21.32,50.5 ; 48.03,24.75 47.78,24.5 v2(44.03,24.5)
PIN12: length 57.2
  Top Layer w0.3: v2(45.94,17.78) 44.92,17.78 43.28,19.25 43.28,21.75 35.48,29.55 35.48,39.17 29.64,45 16.9,45 15.88,46.02 15.88,48.3 16.68,49.1 17.38,49.1 18.78,50.5
  Bottom Layer w0.3: 45.97,15.49 45.97,17.75 v2(45.94,17.78)
PIN13: length 73
  Top Layer w0.3: v2(37.3,25.15) 37.3,25.22 34.68,27.85 34.68,38.84 29.51,44 16.73,44 14.85,45.88 14.85,48.32 16.24,49.71 16.24,50.04 16.47,50.27
  Bottom Layer w0.3: 18.03,42.25 19.03,42.25 20.48,43.7 20.54,47.75 19.27,48.77 17.74,48.77 16.24,50.04 16.24,50.5 ; 50.03,26.75 50.03,23.75 49.2,22.92 46.7,22.92 45.78,22 40.45,22 v2(37.3,25.15)
PINA0: length 6.5
  Bottom Layer w0.3: 37.83,2.54 37.83,5.2 36.03,7 36.03,8.25
PINA1: length 25.1
  Top Layer w0.3: v2(36.03,18.54) v2(36.03,14.99)
  Bottom Layer w0.3: SC4.2 36.03,19.08 v2(36.03,18.54) ; 36.03,12.25 36.03,12 36.72,12 37.44,11.28 37.44,7.84 40.37,4.91 40.37,2.54 ; v2(36.03,14.99) 36.03,12 SCTC1.2
PINA2: length 6.3
  Bottom Layer w0.3: 42.91,2.54 42.91,5.87 40.78,8
PINA3: length 26.3
  Bottom Layer w0.3: SC3.2 40.78,17.13 SCTC2.2 ; 40.78,12 42.32,12 43.14,11.18 43.14,8.38 45.45,6.08 45.45,2.54
PINA4: length 20.3
  Bottom Layer w0.3: 47.99,2.54 47.99,5.29 44.53,8.75 44.53,19.42 45.61,20.5 46.03,20.5
PINA5: length 15.9
  Bottom Layer w0.3: P3.6 50.51,10.16 52.54,12.19 52.54,14.22 51.78,14.99 SCFA.3 49.97,15.49
SCL: length 7.5
  Top Layer w0.3: 8.85,44.19 8.85,44.96 6.06,47.75 P2.1
SDA: length 7.3
  Top Layer w0.3: 10.89,44.19 10.89,45.97 8.6,48.26 P2.2
$1N20: length 6.7
  Top Layer w0.3: C7.2 20.48,33.34 21.42,32.39 DRV8313.3
$1N21: length 6.6
  Top Layer w0.3: DRV8313.2 23.61,33.04 24.09,33.53 24.09,35.81 23.52,36.38 C8.1
$1N22: length 4.2
  Top Layer w0.3: DRV8313.1 22.12,33.81 C8.2
$1N41: length 8
  Top Layer w0.5: v5(24.35,10.67) 26.03,12.35 27.85,12.35
  Bottom Layer w0.3: SC10.2 23.11,9.43 v5(24.35,10.67)
$1N43: length 2.3
  Top Layer w0.3: D1.1 3.78,16.92 3.78,14.73
$1N70: length 29.5
  Top Layer w0.3: PULL_SDA.1 11.4,42.16 29.17,42.16 v2(33.49,37.85)
  Bottom Layer w0.3: v2(33.49,37.85) 33.49,36.07 35.24,34.32 35.86,34.32
$1N110: length 4.4
  Top Layer w0.4: 15.37,28.32 15.84,28.32 16.98,27.18 16.98,26.16 16.41,25.59 CF2.2
$1N112: length 6
  Top Layer w0.4: CS1.6 16.85,19.94 17.68,19.11 17.68,17.37 16.82,16.51 16.16,16.51
$1N114: length 2.7
  Top Layer w0.3: D2.1 34.43,24.12 R3.2
$1N120: length 33
  Top Layer w0.3: v2(32.22,37.08) 28.41,40.89 10.38,40.89 8.85,42.42 PULL_SCL.1
  Bottom Layer w0.3: 34.17,30.7 32.23,32.64 32.23,37.07
$1N122: length 11.9
  Top Layer w0.3: 37.56,43.69 v2(37.56,42.16)
  Bottom Layer w0.3: 42.47,33.82 42.47,36.49 37.56,41.39 v2(37.56,42.16)
$1N125: length 8
  Top Layer w0.3: v2(38.32,38.1) 37.56,38.85 PULL_B1.1
  Bottom Layer w0.3: SCFI1.4 39.81,36.61 v2(38.32,38.1)
$1N126: length 8.6
  Top Layer w0.3: v2(38.32,34.54) 37.56,35.3 PULL_I1.1
  Bottom Layer w0.3: 40.78,30.19 39.62,30.19 37.81,32 37.56,33.27 v2(38.32,34.54)

## Copper pours and planes (outline as drawn; the poured copper is in the pictures)
GND on Top Layer: 1.88,52.99 0.1,51.21 0.1,2.01 2.21,-0.1 52.39,-0.1 57.2,4.71 57.2,36.51 53.8,39.91 53.8,51.71 52.53,52.99
GND on Bottom Layer: 9.64,21.46 8.08,23.02 8.08,31.6 9.6,32.85 21.95,32.85 23.83,31.38 23.83,23.15 22.2,21.52
GND on Bottom Layer: 1.83,53.06 0.05,51.28 0.05,2.08 2.16,-0.03 52.34,-0.03 57.15,4.78 57.15,36.58 53.75,39.98 53.75,51.78 52.48,53.06
VCC on Top Layer: 18.51,27.43 23.08,27.43 23.08,23.88 18.51,23.88
VCC on Top Layer: 18.25,33.27 23.08,33.27 23.08,31.5 18.25,31.5
VCC on Top Layer: 3.52,1.78 3.02,2.28 3.02,6.28 3.01,13.46 3.52,13.97 18,13.97 18.07,10.78 11.52,10.78 7.33,6.86 7.33,2.29 6.82,1.78
VCC on Bottom Layer: 3.01,33.53 20.54,33.53 20.54,1.78 3.01,1.78

## Text on the board
Bottom Silkscreen Layer: SDA | SCL | B | I | A | docs.simplefoc.com / 2024 / 04 | 2024.10.9 | Redesigned / by / Hondomachi | pwm A | 11 | 6 | 13 | pwm B | 9 | 10 | enable | VDD | 7 | 8 | nReset | pwm C | 3 | 5 | phase A | nFault | phase B | B/V | A/U | I/W | Enable 8V / regulator / VIN | DRV8313 / Fault / read & reset | Input / 12-35V | DRV8313 pinout / config PWM & enable | Solder to / enable pullups | VCC | GND | 3.3V | 5V | A1 | I2C | A3 | A0 | A2 | Current sense pinoout & ADC config | Enc/Hall | 4 | 12 | A4 | 2 | A5 | Encoder/Hall pinout config | C
Top Silkscreen Layer: PULL / I2C | + | POWER | VCC | 8-35V | Input | GND | 3.3V | 5V | VIN | PULL A | PULL B | PULL I | VDD | A/U | B/V | I/W | Arduino Headers R3 / BLDC motor (3Amps max) / Encoder/Hall / Current Sense Inline | Simple | project | SCL | SDA | SCK | MISO | MOSI | FALUT | TX | RX | FOC | Shield | V3.2
